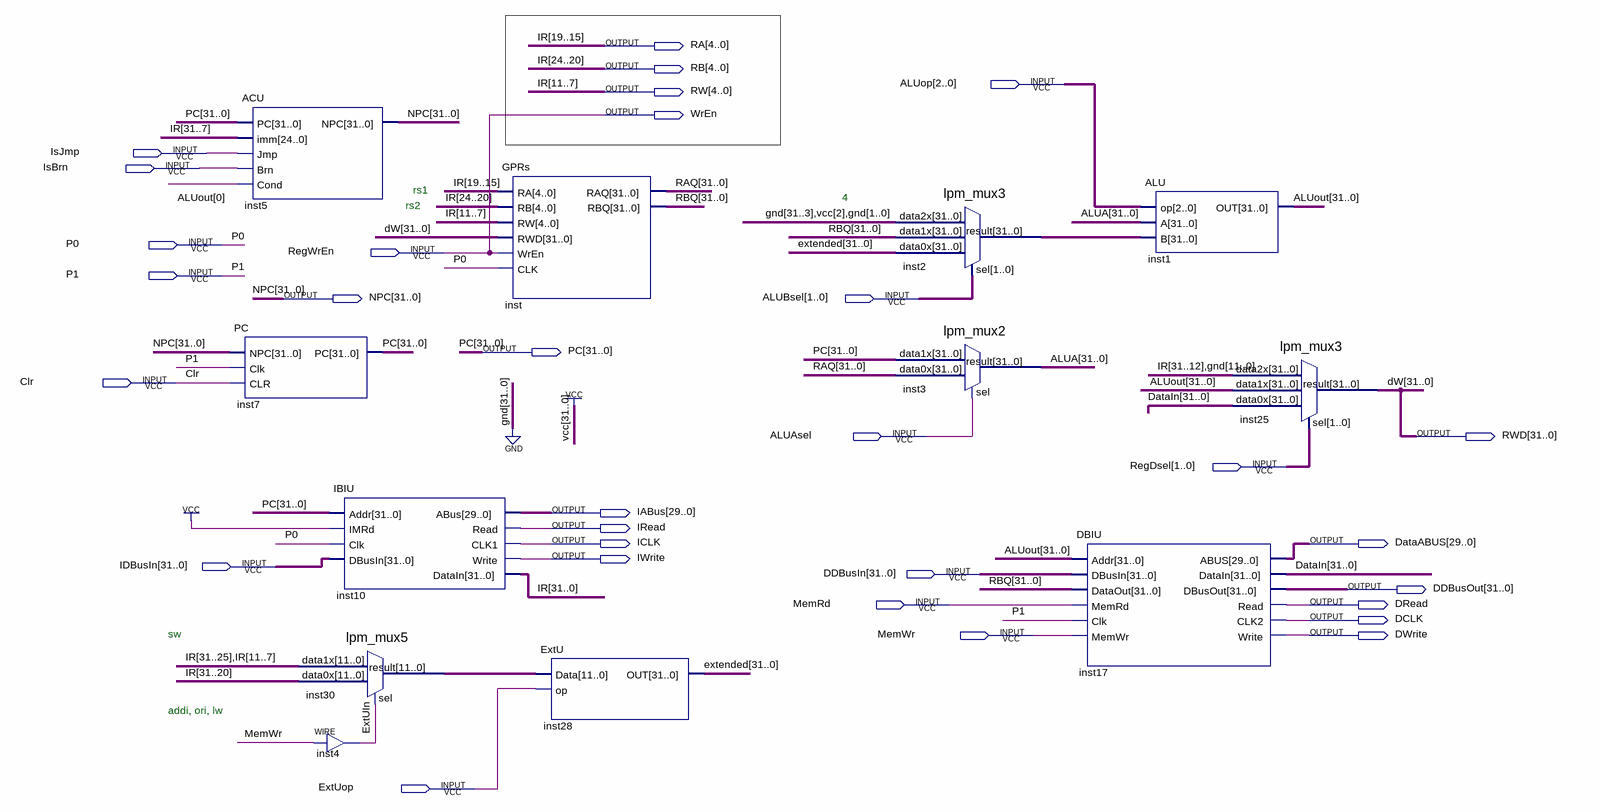
[diagram p0: schematic sheet]
// Quartus schematic datapath.bdf as structural Verilog: 12 symbols, 31 pins
module datapath (
  input  [2:0] ALUop,
  input  IsJmp,
  input  IsBrn,
  input  P0,
  input  RegWrEn,
  input  P1,
  input  [1:0] ALUBsel,
  input  Clr,
  input  ALUAsel,
  input  [1:0] RegDsel,
  input  [31:0] IDBusIn,
  input  [31:0] DDBusIn,
  input  MemRd,
  input  MemWr,
  input  ExtUop,
  output [4:0] RA,
  output [4:0] RB,
  output [4:0] RW,
  output WrEn,
  output [31:0] NPC,
  output [31:0] PC,
  output [31:0] RWD,
  output [29:0] IABus,
  output IRead,
  output ICLK,
  output [29:0] DataABUS,
  output IWrite,
  output [31:0] DDBusOut,
  output DRead,
  output DCLK,
  output DWrite
);

  wire ExtUIn;
  wire [11:0] inst30_result;
  wire [31:0] ALUA, ALUout, DataIn, extended, inst2_result, IR, RAQ, RBQ;

  ACU inst5 (.PC(PC), .imm({IR[31:25], RB, RA, IR[14:12], RW}), .Jmp(IsJmp), .Brn(IsBrn), .Cond(ALUout[0]), .NPC(NPC));
  PC inst7 (.NPC(NPC), .Clk(P1), .CLR(Clr), .PC(PC));
  IBIU inst10 (
    .Addr(PC), .IMRd(1'b1), .Clk(P0), .DBusIn(IDBusIn), .ABus(IABus), .Read(IRead), .CLK1(ICLK),
    .Write(IWrite), .DataIn({IR[31:25], RB, RA, IR[14:12], RW, IR[6:0]}));
  lpm_mux5 inst30 (.data1x({IR[31:25], RW}), .data0x({IR[31:25], RB}), .sel(ExtUIn), .result(inst30_result));
  assign ExtUIn = MemWr;  // WIRE inst4
  GPRs inst (.RA(RA), .RB(RB), .RW(RW), .RWD(RWD), .WrEn(RegWrEn), .CLK(P0), .RAQ(RAQ), .RBQ(RBQ));
  ExtU inst28 (.Data(inst30_result), .op(ExtUop), .OUT(extended));
  lpm_mux3 inst2 (
    .data2x(32'b00000000000000000000000000000100), .data1x(RBQ), .data0x(extended), .sel(ALUBsel),
    .result(inst2_result));
  lpm_mux2 inst3 (.data1x(PC), .data0x(RAQ), .sel(ALUAsel), .result(ALUA));
  DBIU inst17 (
    .Addr(ALUout), .DBusIn(DDBusIn), .DataOut(RBQ), .MemRd(MemRd), .Clk(P1), .MemWr(MemWr), .ABUS(DataABUS),
    .DataIn(DataIn), .DBusOut(DDBusOut), .Read(DRead), .CLK2(DCLK), .Write(DWrite));
  ALU inst1 (.op(ALUop), .A(ALUA), .B(inst2_result), .OUT(ALUout));
  lpm_mux3 inst25 (
    .data2x({IR[31:25], RB, RA, IR[14:12], {12{1'b0}}}), .data1x(ALUout), .data0x(DataIn), .sel(RegDsel),
    .result(RWD));

  assign WrEn = RegWrEn;

  // Other names for the same wires on the sheet: IR (some bits) = {RB, RA, RW}; dW[31:0] = RWD

  // Notes on the sheet:
  //   rs1
  //   4
  //   rs2
  //   sw
  //   addi, ori, lw
endmodule
